# Altium schematic sheet Teensy_Interface.SchDoc
size A4; SheetNumber: 1; SheetTotal: 4
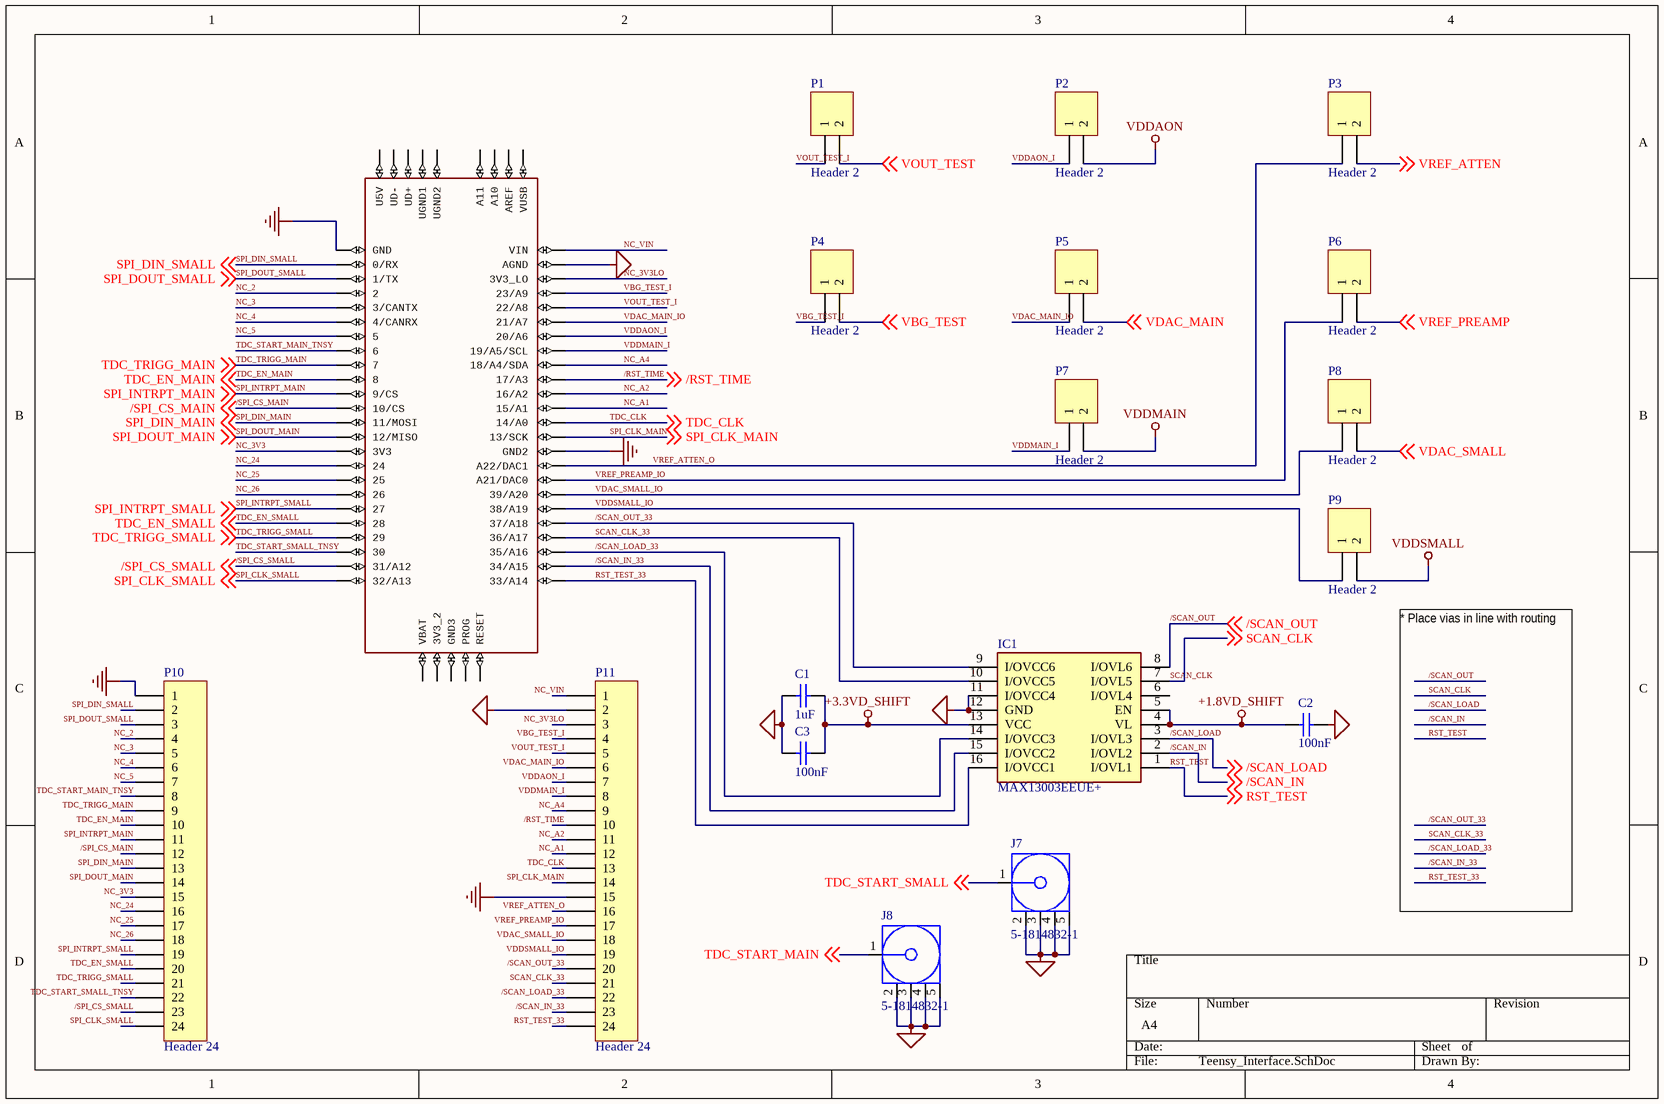
[diagram p0: Teensy_Interface.SchDoc]

## Parts
C1  1uF  [CAPC1608X90X35ML10T15]
C2  100nF  [CAPC1608X90X35ML10T15]
C3  100nF  [CAPC1608X90X35ML10T15]
IC1  MAX13003EEUE+  [SOP65P640X110-16N]
J7  5-1814832-1  [TECO-5-1814832-1_V]
J8  5-1814832-1  [TECO-5-1814832-1_V]
P1  Header 2  [HDR1X2]
P2  Header 2  [HDR1X2]
P3  Header 2  [HDR1X2]
P4  Header 2  [HDR1X2]
P5  Header 2  [HDR1X2]
P6  Header 2  [HDR1X2]
P7  Header 2  [HDR1X2]
P8  Header 2  [HDR1X2]
P9  Header 2  [HDR1X2]
P10  Header 24  [HDR1X24]
P11  Header 24  [HDR1X24]
TEENSY1  TEENSY_3.5/3.6  [TEENSY_3.5/3.6]  (value not drawn)

## Nets
+1.8VD_SHIFT: C2.1 IC1.4(VL) IC1.5(EN)
+3.3VD_SHIFT: C1.2 C3.2 IC1.13(VCC)
GND: C1.1 C2.2 C3.1 IC1.11(I/OVCC4) IC1.12(GND) J7.2 J7.3 J7.4 J7.5 J8.2 J8.3 J8.4 J8.5 P10.1 P11.2 P11.15 TEENSY1.AGND TEENSY1.GND TEENSY1.GND2
VDDAON: P2.2
VDDMAIN: P7.2
VDDSMALL: P9.2
/RST_TIME: P11.10 TEENSY1.17/A3 ; off-sheet /RST_TIME
/SCAN_IN: IC1.2(I/OVL2) ; off-sheet /SCAN_IN
/SCAN_IN_33: IC1.15(I/OVCC2) P11.23 TEENSY1.34/A15
/SCAN_LOAD: IC1.3(I/OVL3) ; off-sheet /SCAN_LOAD
/SCAN_LOAD_33: IC1.14(I/OVCC3) P11.22 TEENSY1.35/A16
/SCAN_OUT: IC1.8(I/OVL6) ; off-sheet /SCAN_OUT
/SCAN_OUT_33: IC1.9(I/OVCC6) P11.20 TEENSY1.37/A18
/SPI_CS_MAIN: P10.12 TEENSY1.10/CS ; off-sheet /SPI_CS_MAIN
/SPI_CS_SMALL: P10.23 TEENSY1.31/A12 ; off-sheet /SPI_CS_SMALL
NC_2: P10.4 TEENSY1.2
NC_3: P10.5 TEENSY1.3/CANTX
NC_3V3: P10.15 TEENSY1.3V3
NC_3V3LO: P11.3 TEENSY1.3V3_LO
NC_4: P10.6 TEENSY1.4/CANRX
NC_5: P10.7 TEENSY1.5
NC_24: P10.16 TEENSY1.24
NC_25: P10.17 TEENSY1.25
NC_26: P10.18 TEENSY1.26
NC_A1: P11.12 TEENSY1.15/A1
NC_A2: P11.11 TEENSY1.16/A2
NC_A4: P11.9 TEENSY1.18/A4/SDA
NC_VIN: P11.1 TEENSY1.VIN
RST_TEST: IC1.1(I/OVL1) ; off-sheet RST_TEST
RST_TEST_33: IC1.16(I/OVCC1) P11.24 TEENSY1.33/A14
SCAN_CLK: IC1.7(I/OVL5) ; off-sheet SCAN_CLK
SCAN_CLK_33: IC1.10(I/OVCC5) P11.21 TEENSY1.36/A17
SPI_CLK_MAIN: P11.14 TEENSY1.13/SCK ; off-sheet SPI_CLK_MAIN
SPI_CLK_SMALL: P10.24 TEENSY1.32/A13 ; off-sheet SPI_CLK_SMALL
SPI_DIN_MAIN: P10.13 TEENSY1.11/MOSI ; off-sheet SPI_DIN_MAIN
SPI_DIN_SMALL: P10.2 TEENSY1.0/RX ; off-sheet SPI_DIN_SMALL
SPI_DOUT_MAIN: P10.14 TEENSY1.12/MISO ; off-sheet SPI_DOUT_MAIN
SPI_DOUT_SMALL: P10.3 TEENSY1.1/TX ; off-sheet SPI_DOUT_SMALL
SPI_INTRPT_MAIN: P10.11 TEENSY1.9/CS ; off-sheet SPI_INTRPT_MAIN
SPI_INTRPT_SMALL: P10.19 TEENSY1.27 ; off-sheet SPI_INTRPT_SMALL
TDC_CLK: P11.13 TEENSY1.14/A0 ; off-sheet TDC_CLK
TDC_EN_MAIN: P10.10 TEENSY1.8 ; off-sheet TDC_EN_MAIN
TDC_EN_SMALL: P10.20 TEENSY1.28 ; off-sheet TDC_EN_SMALL
TDC_START_MAIN: J8.1 ; off-sheet TDC_START_MAIN
TDC_START_MAIN_TNSY: P10.8 TEENSY1.6
TDC_START_SMALL: J7.1 ; off-sheet TDC_START_SMALL
TDC_START_SMALL_TNSY: P10.22 TEENSY1.30
TDC_TRIGG_MAIN: P10.9 TEENSY1.7 ; off-sheet TDC_TRIGG_MAIN
TDC_TRIGG_SMALL: P10.21 TEENSY1.29 ; off-sheet TDC_TRIGG_SMALL
VBG_TEST: P4.2 ; off-sheet VBG_TEST
VBG_TEST_I: P4.1 P11.4 TEENSY1.23/A9
VDAC_MAIN: P5.2 ; off-sheet VDAC_MAIN
VDAC_MAIN_IO: P5.1 P11.6 TEENSY1.21/A7
VDAC_SMALL: P8.2 ; off-sheet VDAC_SMALL
VDAC_SMALL_IO: P8.1 P11.18 TEENSY1.39/A20
VDDAON_I: P2.1 P11.7 TEENSY1.20/A6
VDDMAIN_I: P7.1 P11.8 TEENSY1.19/A5/SCL
VDDSMALL_IO: P9.1 P11.19 TEENSY1.38/A19
VOUT_TEST: P1.2 ; off-sheet VOUT_TEST
VOUT_TEST_I: P1.1 P11.5 TEENSY1.22/A8
VREF_ATTEN: P3.2 ; off-sheet VREF_ATTEN
VREF_ATTEN_O: P3.1 P11.16 TEENSY1.A22/DAC1
VREF_PREAMP: P6.2 ; off-sheet VREF_PREAMP
VREF_PREAMP_IO: P6.1 P11.17 TEENSY1.21/DAC0(A21/DAC0)

Not connected (* = marked no-connect by the designer): IC1 6(I/OVL4); TEENSY1 3V3_2 A10 A11 AREF GND3 PROG RESET U5V UD+ UD- UGND1 UGND2 VBAT VUSB

## Notes on the sheet
- * Place vias in line with routing

## Library data of the parts
C1-C3 = CMP-2000-04945-1: 0603; Manufacturer: Murata; Capacitance: 22pF; Tolerance (%): ±5%; Rated Voltage: 50V; Dielectric: C0G; Manufacturer URL: http://www.murata.com/; Datasheet Version: Jul-06; Package Reference: 603; Case Size/Dimension: 0603; Package Description: 2-Pin Surface Mount Device, Body 1.6 x 0.8 mm; Datasheet URL: https://datasheet.ciiva.com/11786/0900766b807a1cab-11786398.pdf
IC1 = MAX13003EEUE+: Integrated Circuit; Manufacturer_Name: Maxim Integrated; Datasheet Link: https://pdfserv.maximintegrated.com/en/ds/MAX13000E-MAX13005E.pdf; Height: 1.1mm; Manufacturer_Part_Number: MAX13003EEUE+
J7 J8 = CMP-2000-05415-1: SMA Connector, Pitch 5.08 mm, 1 Position, Height 9.5 mm, Tail Length 4 mm, -65 to 165 degC, RoHS, Bulk; Manufacturer: TE Connectivity; Connector Mounting: PCBMount; Connector Body Style: StraightJack; Impedance: 50ohm; Coaxial Termination: Solder; SVHC: NoSVHC(15-Jun-2015); Frequency Max: 3GHz; Product Range: ZDCSeries; Connector Type: SMACoaxial; Datasheet Version: Rev. B1, 03/2011; Package Reference: 5-1814832-1; Package Description: SMA Connector, Pitch 5.08 mm, 1 Position, Height 9.5 mm, Tail Length 4 mm; Contact Plating: GoldPlatedContacts; Coaxial Cable Types: -; Contact Material: BerylliumCopper; Manufacturer URL: http://www.te.com/; Datasheet URL: http://www.onlinecomponents.com/productFiles/mf-AMP/eng_cd_1814832_a.pdf
P1-P9 = Header 2: Header, 2-Pin; LatestRevisionDate: 17-Jul-2002; LatestRevisionNote: Re-released for DXP Platform.; Publisher: Altium Limited
P10 P11 = Header 24: Header, 24-Pin; LatestRevisionDate: 17-Jul-2002; LatestRevisionNote: Re-released for DXP Platform.; Publisher: Altium Limited
TEENSY1 = TEENSY_3.5/3.6: GateName_1: G$1; SymbolName_1: TEENSY_3.5/3.6; LibraryName: Teensy356; DeviceSetName: TEENSY_3.5/3.6; Package: TEENSY_3.5/3.6